# EAGLE design dcp (EAGLE 6.1)
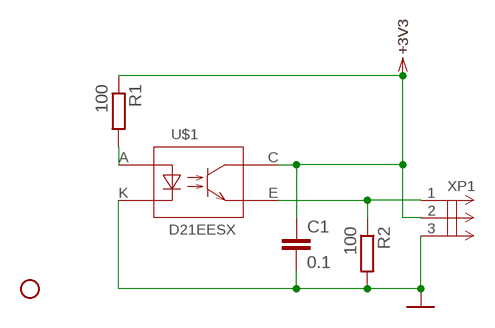
[diagram p0: schematic, sheet 1]

## Parts
C1  0.1  CAP0805  [0805]
JP1  STAND-OFF-M3  [STAND-OFF-M3]
R1  100  RESISTOR0805  [0805]
R2  100  RESISTOR0805  [0805]
U$1  D21EESX  [D21EESX]
XP1  PLD_1X03LONGPAD  [PLD_1X03_LONGPAD]

## Nets
+3V3: C1.1 R1.1 U$1.C(TC) XP1.2
GND: C1.2 R2.2 U$1.K(DC) XP1.3
N$2: R2.1 U$1.E(TE) XP1.1
N$3: R1.2 U$1.A(DA)

## Library data of the parts
C1 = barthess:CAP: Capacitor; PARTNO: ?
JP1 = mount:STAND-OFF-*: Stand Off This is the mechanical footprint for a #4 phillips button head screw. Use the keepout ring to avoid running the screw head into surrounding components. SKU : PRT-00447
R1 R2 = barthess:RESISTOR: Resistor
U$1 = optocoupler:D21EESX
XP1 = connector:PLD_1X03

## Board
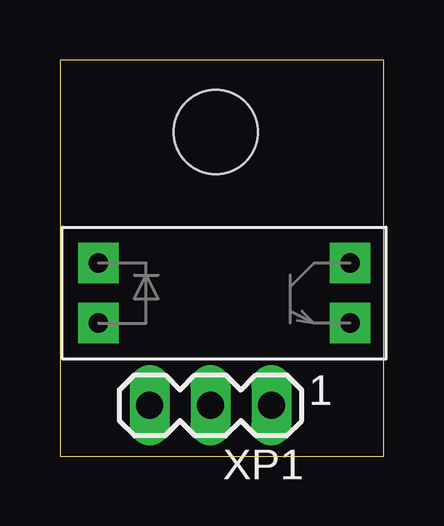
[diagram p1: board, top side]
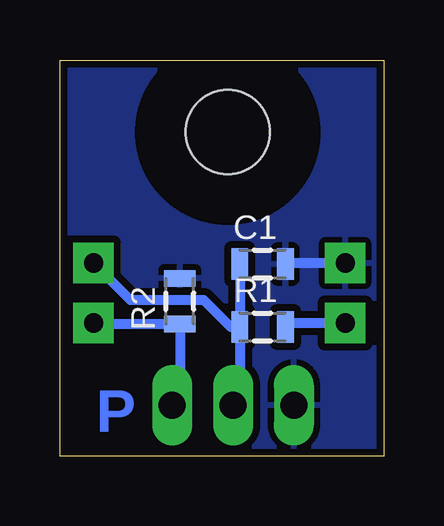
[diagram p2: board, bottom side, seen from below]

Size 13.5 x 16.5 mm. Coordinates in mm from the lower left corner, seen from the top.
Outline: 0,0 13.5,0 13.5,16.5 0,16.5 0,0
Copper layers (1*16): Top 0.035mm / dielectric 1.5mm / Bottom 0.035mm
Design rules: minimum track width 10mil, minimum drill 24mil, track to track 8mil, track to pad 8mil, pad to pad 8mil, via to via 8mil, smd to smd 8mil, copper to edge 4mil, drill to drill 8mil, minimum pad ring 10mil, minimum via ring 8mil, stop-mask expansion 4mil, vias tented up to drill 0mil, thermal gap 10mil

### Footprints (pad centres in the part's own frame; a part is rotated, then mirrored left to right if it is on the bottom)
0805 = smd 0.7 x 1.3: 1 -1,0; 2 0.9,0
STAND-OFF-M3 = hole 3.5: 0,0
D21EESX = drill 0.8 pad 1.676 square: A 0,0; C 10.5,2.5; E 10.5,0; K 0,2.5
PLD_1X03_LONGPAD = drill 1.118 long: 1 0,0; 2 2.54,0; 3 5.08,0

### Placement (x,y rotation side)
C1  5,8 0 bottom
JP1  6.5,13.5 0 top
R1  5,5.38 0 bottom
R2  8.5,6.5 90 bottom
U$1  1.6,5.54 0 top
XP1  8.82,2.11 180 top

### Tracks (layer width: path | path; a pad name or v marks a point on that pad's centre or on a via)
+3V3
  Bottom 0.406: C1.1 R1.1 | R1.1 6.38,5.38 7.5,6.5 10.56,6.5 U$1.C | R1.1 6,2.39 XP1.2
GND
  Bottom 0.406: U$1.K 4,8.04 4,8
  pour Bottom (isolate 0.3, hatched): 0,16.5 13.5,16.5 13.5,0 0,0
N$2
  Bottom 0.406: XP1.1 8.5,2.43 R2.1 12.06,5.5 U$1.E
N$3
  Bottom 0.406: U$1.A 3.94,5.54 R1.2

### Text on the board
Bottom: P